# Altium project EL.T01.CVCM.PrjPcb (part 1 of 2)
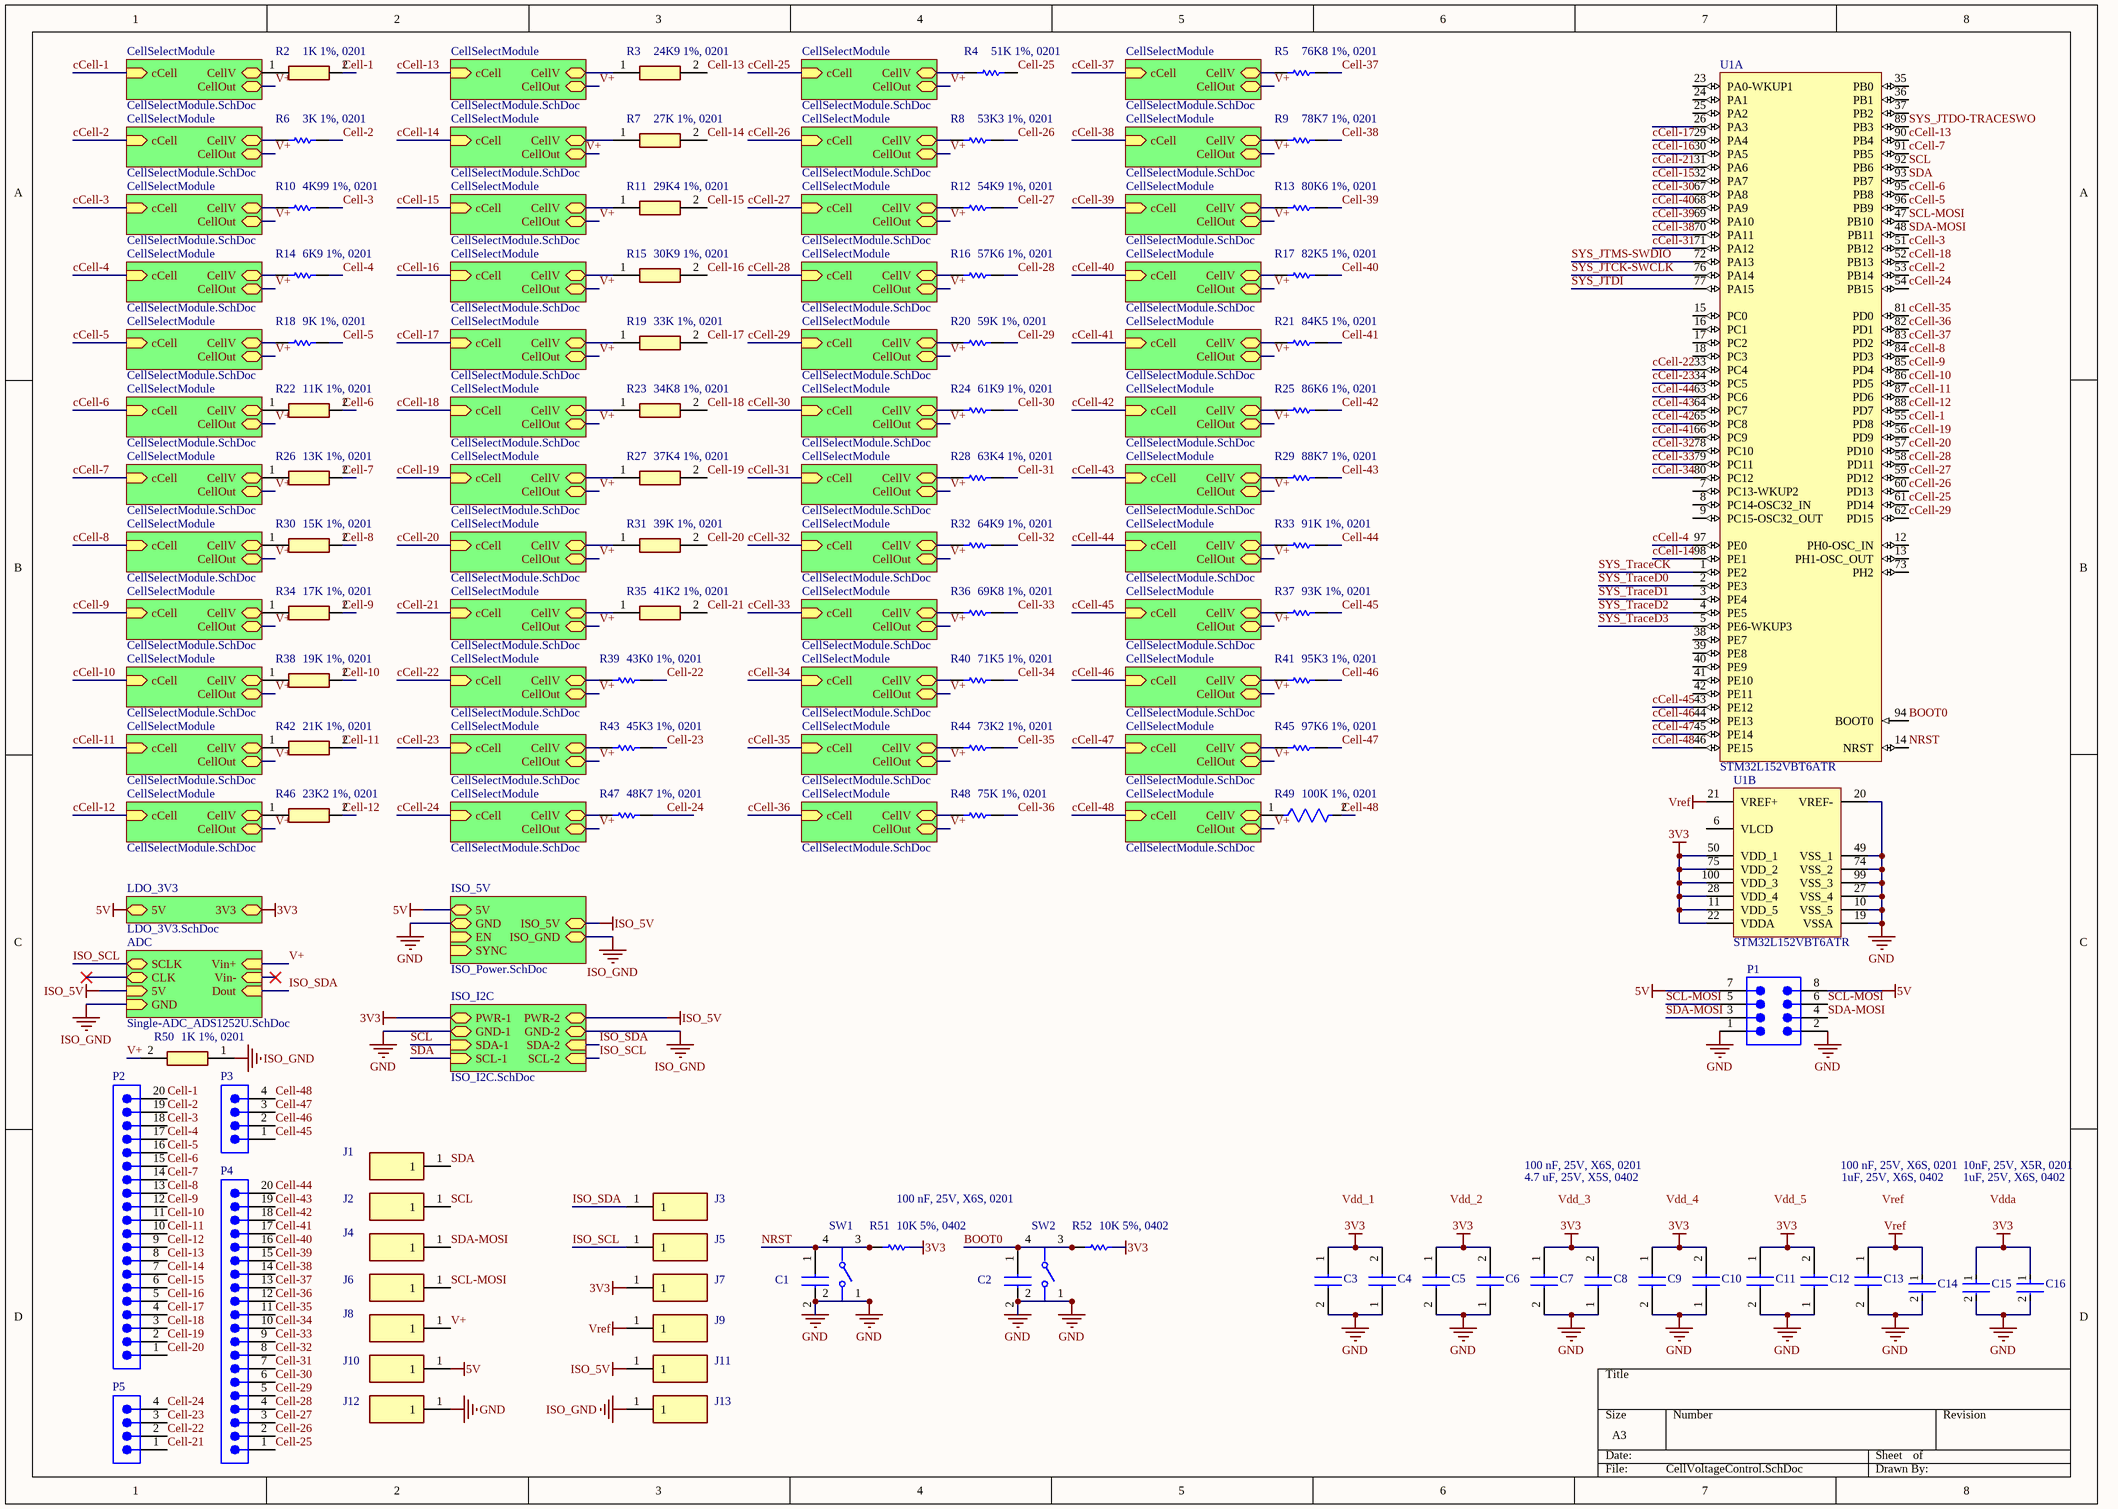
[diagram p0: CellVoltageControl.SchDoc]
7 sheets, 216 parts. Net scope: hierarchical (ports join the sheet entries above them; power ports are global).
Board file: CellVoltageControl.PcbDoc
Sheets:
  CellVoltageControl.SchDoc
    CellSelectModule = CellSelectModule.SchDoc
    CellSelectModule = CellSelectModule.SchDoc
    CellSelectModule = CellSelectModule.SchDoc
    CellSelectModule = CellSelectModule.SchDoc
    CellSelectModule = CellSelectModule.SchDoc
    CellSelectModule = CellSelectModule.SchDoc
    CellSelectModule = CellSelectModule.SchDoc
    CellSelectModule = CellSelectModule.SchDoc
    CellSelectModule = CellSelectModule.SchDoc
    CellSelectModule = CellSelectModule.SchDoc
    CellSelectModule = CellSelectModule.SchDoc
    CellSelectModule = CellSelectModule.SchDoc
    CellSelectModule = CellSelectModule.SchDoc
    CellSelectModule = CellSelectModule.SchDoc
    CellSelectModule = CellSelectModule.SchDoc
    CellSelectModule = CellSelectModule.SchDoc
    CellSelectModule = CellSelectModule.SchDoc
    CellSelectModule = CellSelectModule.SchDoc
    CellSelectModule = CellSelectModule.SchDoc
    CellSelectModule = CellSelectModule.SchDoc
    CellSelectModule = CellSelectModule.SchDoc
    CellSelectModule = CellSelectModule.SchDoc
    CellSelectModule = CellSelectModule.SchDoc
    CellSelectModule = CellSelectModule.SchDoc
    CellSelectModule = CellSelectModule.SchDoc
    CellSelectModule = CellSelectModule.SchDoc
    CellSelectModule = CellSelectModule.SchDoc
    CellSelectModule = CellSelectModule.SchDoc
    CellSelectModule = CellSelectModule.SchDoc
    CellSelectModule = CellSelectModule.SchDoc
    CellSelectModule = CellSelectModule.SchDoc
    CellSelectModule = CellSelectModule.SchDoc
    CellSelectModule = CellSelectModule.SchDoc
    CellSelectModule = CellSelectModule.SchDoc
    CellSelectModule = CellSelectModule.SchDoc
    CellSelectModule = CellSelectModule.SchDoc
    CellSelectModule = CellSelectModule.SchDoc
    CellSelectModule = CellSelectModule.SchDoc
    CellSelectModule = CellSelectModule.SchDoc
    CellSelectModule = CellSelectModule.SchDoc
    CellSelectModule = CellSelectModule.SchDoc
    CellSelectModule = CellSelectModule.SchDoc
    CellSelectModule = CellSelectModule.SchDoc
    CellSelectModule = CellSelectModule.SchDoc
    CellSelectModule = CellSelectModule.SchDoc
    CellSelectModule = CellSelectModule.SchDoc
    CellSelectModule = CellSelectModule.SchDoc
    CellSelectModule = CellSelectModule.SchDoc
    LDO_3V3 = LDO_3V3.SchDoc
    ISO_5V = ISO_Power.SchDoc
    ISO_I2C = ISO_I2C.SchDoc
    ADC = Single-ADC_ADS1252U.SchDoc
      Vref-2v5 = Reference_2V5.SchDoc

## Sheet CellVoltageControl.SchDoc
size A3; SheetNumber: 1; SheetTotal: 7

### Parts
C1  100 nF, 25V, X6S, 0201  [CAPC0603X33N]  (value not drawn)
C2  100 nF, 25V, X6S, 0201  [CAPC0603X33N]  (value not drawn)
C3  100 nF, 25V, X6S, 0201  [CAPC0603X33N]  (value not drawn)
C4  4.7 uF, 25V, X5S, 0402  [GRM15x]  (value not drawn)
C5  100 nF, 25V, X6S, 0201  [CAPC0603X33N]  (value not drawn)
C6  4.7 uF, 25V, X5S, 0402  [GRM15x]  (value not drawn)
C7  100 nF, 25V, X6S, 0201  [CAPC0603X33N]  (value not drawn)
C8  4.7 uF, 25V, X5S, 0402  [GRM15x]  (value not drawn)
C9  100 nF, 25V, X6S, 0201  [CAPC0603X33N]  (value not drawn)
C10  4.7 uF, 25V, X5S, 0402  [GRM15x]  (value not drawn)
C11  100 nF, 25V, X6S, 0201  [CAPC0603X33N]  (value not drawn)
C12  4.7 uF, 25V, X5S, 0402  [GRM15x]  (value not drawn)
C13  100 nF, 25V, X6S, 0201  [CAPC0603X33N]  (value not drawn)
C14  1uF, 25V, X6S, 0402  [FP-GRT155-0_1-IPC_A]  (value not drawn)
C15  10nF, 25V, X5R, 0201  [FP-GRM033-0_03-IPC_C]  (value not drawn)
C16  1uF, 25V, X6S, 0402  [FP-GRT155-0_1-IPC_A]  (value not drawn)
J1  TestPad  [TestPad]  (value not drawn)  (no BOM)
J2  TestPad  [TestPad]  (value not drawn)  (no BOM)
J3  TestPad  [TestPad]  (value not drawn)  (no BOM)
J4  TestPad  [TestPad]  (value not drawn)  (no BOM)
J5  TestPad  [TestPad]  (value not drawn)  (no BOM)
J6  TestPad  [TestPad]  (value not drawn)  (no BOM)
J7  TestPad  [TestPad]  (value not drawn)  (no BOM)
J8  TestPad  [TestPad]  (value not drawn)  (no BOM)
J9  TestPad  [TestPad]  (value not drawn)  (no BOM)
J10  TestPad  [TestPad]  (value not drawn)  (no BOM)
J11  TestPad  [TestPad]  (value not drawn)  (no BOM)
J12  TestPad  [TestPad]  (value not drawn)  (no BOM)
J13  TestPad  [TestPad]  (value not drawn)  (no BOM)
P1  61200821621  [61200821621]  (value not drawn)
P2  61302011121  [61302011121]  (value not drawn)
P3  61300411121  [61300411121]  (value not drawn)
P4  61302011121  [61302011121]  (value not drawn)
P5  61300411121  [61300411121]  (value not drawn)
R2  1K 1%, 0201  [ERJ1GN_(0201)]
R3  24K9 1%, 0201  [ERJ1GN_(0201)]
R4  51K 1%, 0201  [RESC0603X26X15NL03T05]
R5  76K8 1%, 0201  [RESC0603X26X15LL03T05]
R6  3K 1%, 0201  [RESC0603X26X15ML03T05]
R7  27K 1%, 0201  [ERJ1GN_(0201)]
R8  53K3 1%, 0201  [RESC0201(0603)_M]
R9  78K7 1%, 0201  [RESC0603X26X15NL03T05]
R10  4K99 1%, 0201  [RESC0603X26X15LL03T05]
R11  29K4 1%, 0201  [ERJ1GN_(0201)]
R12  54K9 1%, 0201  [RESC0603X26X15NL03T05]
R13  80K6 1%, 0201  [RESC0201(0603)_L]
R14  6K9 1%, 0201  [RESC0603X26X15NL03T05]
R15  30K9 1%, 0201  [ERJ1GN_(0201)]
R16  57K6 1%, 0201  [RESC0603X26X15NL03T05]
R17  82K5 1%, 0201  [RESC0603X26X15NL03T05]
R18  9K 1%, 0201  [RESC0603X26X15NL03T05]
R19  33K 1%, 0201  [ERJ1GN_(0201)]
R20  59K 1%, 0201  [RESC0603X26X15NL03T05]
R21  84K5 1%, 0201  [RESC0603X26X15NL03T05]
R22  11K 1%, 0201  [ERJ1GN_(0201)]
R23  34K8 1%, 0201  [ERJ1GN_(0201)]
R24  61K9 1%, 0201  [RESC0603X26X15NL03T05]
R25  86K6 1%, 0201  [RESC0603X26X15LL03T05]
R26  13K 1%, 0201  [ERJ1GN_(0201)]
R27  37K4 1%, 0201  [ERJ1GN_(0201)]
R28  63K4 1%, 0201  [RESC0201(0603)_M]
R29  88K7 1%, 0201  [RESC0603X26X15LL03T05]
R30  15K 1%, 0201  [ERJ1GJJ2R4C]
R31  39K 1%, 0201  [ERJ1GN_(0201)]
R32  64K9 1%, 0201  [RESC0603X26X15LL03T05]
R33  91K 1%, 0201  [RESC0603X26X15NL03T05]
R34  17K 1%, 0201  [ERJ1GN_(0201)]
R35  41K2 1%, 0201  [ERJ1GN_(0201)]
R36  69K8 1%, 0201  [RESC0603X26X15LL03T05]
R37  93K 1%, 0201  [RESC0201(0603)_L]
R38  19K 1%, 0201  [ERJ1GN_(0201)]
R39  43K0 1%, 0201  [RESC0603X26X15LL03T05]
R40  71K5 1%, 0201  [RESC0603X26X15LL03T05]
R41  95K3 1%, 0201  [RESC0603X26X15ML03T05]
R42  21K 1%, 0201  [ERJ1GN_(0201)]
R43  45K3 1%, 0201  [RESC0201(0603)_N]
R44  73K2 1%, 0201  [RESC0603X26X15NL03T05]
R45  97K6 1%, 0201  [RESC0603X26X15ML03T05]
R46  23K2 1%, 0201  [ERJ1GN_(0201)]
R47  48K7 1%, 0201  [RESC0603X26X15LL03T05]
R48  75K 1%, 0201  [RESC0603X26X15ML03T05]
R49  100K 1%, 0201  [FP-ERJ1GN-IPC_A]
R50  1K 1%, 0201  [ERJ1GN_(0201)]
R51  10K 5%, 0402  [RESC1005X40X25ML05T05]
R52  10K 5%, 0402  [RESC1005X40X25ML05T05]
SW1  PTS810SJM250SMTRLFS  [FP-PTS810SJM250SMTRLFS-MFG]  (value not drawn)
SW2  PTS810SJM250SMTRLFS  [FP-PTS810SJM250SMTRLFS-MFG]  (value not drawn)
U1  STM32L152VBT6ATR  [STM-LQFP100_L]  (parts A,B of 2)

### Sub-sheets
ADC = Single-ADC_ADS1252U.SchDoc: Vin+ (in), SCLK (bidir), CLK (bidir), Vin- (in), 5V (in), GND (in), Dout (in)
CellSelectModule = CellSelectModule.SchDoc: cCell (in), CellV (bidir), CellOut (bidir)
CellSelectModule = CellSelectModule.SchDoc: cCell (in), CellV (bidir), CellOut (bidir)
CellSelectModule = CellSelectModule.SchDoc: cCell (in), CellV (bidir), CellOut (bidir)
CellSelectModule = CellSelectModule.SchDoc: cCell (in), CellV (bidir), CellOut (bidir)
CellSelectModule = CellSelectModule.SchDoc: cCell (in), CellV (bidir), CellOut (bidir)
CellSelectModule = CellSelectModule.SchDoc: cCell (in), CellV (bidir), CellOut (bidir)
CellSelectModule = CellSelectModule.SchDoc: cCell (in), CellV (bidir), CellOut (bidir)
CellSelectModule = CellSelectModule.SchDoc: cCell (in), CellV (bidir), CellOut (bidir)
CellSelectModule = CellSelectModule.SchDoc: cCell (in), CellV (bidir), CellOut (bidir)
CellSelectModule = CellSelectModule.SchDoc: cCell (in), CellV (bidir), CellOut (bidir)
CellSelectModule = CellSelectModule.SchDoc: cCell (in), CellV (bidir), CellOut (bidir)
CellSelectModule = CellSelectModule.SchDoc: cCell (in), CellV (bidir), CellOut (bidir)
CellSelectModule = CellSelectModule.SchDoc: cCell (in), CellV (bidir), CellOut (bidir)
CellSelectModule = CellSelectModule.SchDoc: cCell (in), CellV (bidir), CellOut (bidir)
CellSelectModule = CellSelectModule.SchDoc: cCell (in), CellV (bidir), CellOut (bidir)
CellSelectModule = CellSelectModule.SchDoc: cCell (in), CellV (bidir), CellOut (bidir)
CellSelectModule = CellSelectModule.SchDoc: cCell (in), CellV (bidir), CellOut (bidir)
CellSelectModule = CellSelectModule.SchDoc: cCell (in), CellV (bidir), CellOut (bidir)
CellSelectModule = CellSelectModule.SchDoc: cCell (in), CellV (bidir), CellOut (bidir)
CellSelectModule = CellSelectModule.SchDoc: cCell (in), CellV (bidir), CellOut (bidir)
CellSelectModule = CellSelectModule.SchDoc: cCell (in), CellV (bidir), CellOut (bidir)
CellSelectModule = CellSelectModule.SchDoc: cCell (in), CellV (bidir), CellOut (bidir)
CellSelectModule = CellSelectModule.SchDoc: cCell (in), CellV (bidir), CellOut (bidir)
CellSelectModule = CellSelectModule.SchDoc: cCell (in), CellV (bidir), CellOut (bidir)
CellSelectModule = CellSelectModule.SchDoc: cCell (in), CellV (bidir), CellOut (bidir)
CellSelectModule = CellSelectModule.SchDoc: cCell (in), CellV (bidir), CellOut (bidir)
CellSelectModule = CellSelectModule.SchDoc: cCell (in), CellV (bidir), CellOut (bidir)
CellSelectModule = CellSelectModule.SchDoc: cCell (in), CellV (bidir), CellOut (bidir)
CellSelectModule = CellSelectModule.SchDoc: cCell (in), CellV (bidir), CellOut (bidir)
CellSelectModule = CellSelectModule.SchDoc: cCell (in), CellV (bidir), CellOut (bidir)
CellSelectModule = CellSelectModule.SchDoc: cCell (in), CellV (bidir), CellOut (bidir)
CellSelectModule = CellSelectModule.SchDoc: cCell (in), CellV (bidir), CellOut (bidir)
CellSelectModule = CellSelectModule.SchDoc: cCell (in), CellV (bidir), CellOut (bidir)
CellSelectModule = CellSelectModule.SchDoc: cCell (in), CellV (bidir), CellOut (bidir)
CellSelectModule = CellSelectModule.SchDoc: cCell (in), CellV (bidir), CellOut (bidir)
CellSelectModule = CellSelectModule.SchDoc: cCell (in), CellV (bidir), CellOut (bidir)
CellSelectModule = CellSelectModule.SchDoc: cCell (in), CellV (bidir), CellOut (bidir)
CellSelectModule = CellSelectModule.SchDoc: cCell (in), CellV (bidir), CellOut (bidir)
CellSelectModule = CellSelectModule.SchDoc: cCell (in), CellV (bidir), CellOut (bidir)
CellSelectModule = CellSelectModule.SchDoc: cCell (in), CellV (bidir), CellOut (bidir)
CellSelectModule = CellSelectModule.SchDoc: cCell (in), CellV (bidir), CellOut (bidir)
CellSelectModule = CellSelectModule.SchDoc: cCell (in), CellV (bidir), CellOut (bidir)
CellSelectModule = CellSelectModule.SchDoc: cCell (in), CellV (bidir), CellOut (bidir)
CellSelectModule = CellSelectModule.SchDoc: cCell (in), CellV (bidir), CellOut (bidir)
CellSelectModule = CellSelectModule.SchDoc: cCell (in), CellV (bidir), CellOut (bidir)
CellSelectModule = CellSelectModule.SchDoc: cCell (in), CellV (bidir), CellOut (bidir)
CellSelectModule = CellSelectModule.SchDoc: cCell (in), CellV (bidir), CellOut (bidir)
CellSelectModule = CellSelectModule.SchDoc: cCell (in), CellV (bidir), CellOut (bidir)
ISO_5V = ISO_Power.SchDoc: ISO_5V (bidir), 5V (bidir), GND (bidir), ISO_GND (bidir), EN (in), SYNC (in)
ISO_I2C = ISO_I2C.SchDoc: PWR-2 (bidir), PWR-1 (bidir), GND-1 (bidir), GND-2 (bidir), SDA-1 (in), SCL-1 (in), SDA-2 (in), SCL-2 (in)
LDO_3V3 = LDO_3V3.SchDoc: 3V3 (bidir), 5V (bidir)

### Nets
3V3: C3.1 C4.2 C5.1 C6.2 C7.1 C8.2 C9.1 C10.2 C11.1 C12.2 C15.1 C16.1 J7.1 R51.1 R52.1 U1.11(VDD_5) U1.22(VDDA) U1.28(VDD_4) U1.50(VDD_1) U1.75(VDD_2) U1.100(VDD_3) ; sheet LDO_3V3/3V3, sheet ISO_I2C/PWR-1
5V: J10.1 P1.7 P1.8 ; sheet LDO_3V3/5V, sheet ISO_5V/5V
GND: C1.2 C2.2 C3.2 C4.1 C5.2 C6.1 C7.2 C8.1 C9.2 C10.1 C11.2 C12.1 C13.2 C14.2 C15.2 C16.2 J12.1 P1.1 P1.2 SW1.1 SW1.2 SW2.1 SW2.2 U1.10(VSS_5) U1.19(VSSA) U1.20(VREF-) U1.27(VSS_4) U1.49(VSS_1) U1.74(VSS_2) U1.99(VSS_3) ; sheet ISO_5V/GND, sheet ISO_I2C/GND-1
ISO_5V: J11.1 ; sheet ISO_5V/ISO_5V, sheet ISO_I2C/PWR-2, sheet ADC/5V
ISO_GND: J13.1 R50.1 ; sheet ISO_5V/ISO_GND, sheet ISO_I2C/GND-2, sheet ADC/GND
Vref: C13.1 C14.1 J9.1 U1.21(VREF+)
BOOT0: C2.1 R52.2 SW2.3 SW2.4 U1.94(BOOT0)
cCell-1: U1.55(PD8) ; sheet CellSelectModule/cCell
cCell-2: U1.53(PB14) ; sheet CellSelectModule/cCell
cCell-3: U1.51(PB12) ; sheet CellSelectModule/cCell
cCell-4: U1.97(PE0) ; sheet CellSelectModule/cCell
cCell-5: U1.96(PB9) ; sheet CellSelectModule/cCell
cCell-6: U1.95(PB8) ; sheet CellSelectModule/cCell
cCell-7: U1.91(PB5) ; sheet CellSelectModule/cCell
cCell-8: U1.84(PD3) ; sheet CellSelectModule/cCell
cCell-9: U1.85(PD4) ; sheet CellSelectModule/cCell
cCell-10: U1.86(PD5) ; sheet CellSelectModule/cCell
cCell-11: U1.87(PD6) ; sheet CellSelectModule/cCell
cCell-12: U1.88(PD7) ; sheet CellSelectModule/cCell
cCell-13: U1.90(PB4) ; sheet CellSelectModule/cCell
cCell-14: U1.98(PE1) ; sheet CellSelectModule/cCell
cCell-15: U1.32(PA7) ; sheet CellSelectModule/cCell
cCell-16: U1.30(PA5) ; sheet CellSelectModule/cCell
cCell-17: U1.29(PA4) ; sheet CellSelectModule/cCell
cCell-18: U1.52(PB13) ; sheet CellSelectModule/cCell
cCell-19: U1.56(PD9) ; sheet CellSelectModule/cCell
cCell-20: U1.57(PD10) ; sheet CellSelectModule/cCell
cCell-21: U1.31(PA6) ; sheet CellSelectModule/cCell
cCell-22: U1.33(PC4) ; sheet CellSelectModule/cCell
cCell-23: U1.34(PC5) ; sheet CellSelectModule/cCell
cCell-24: U1.54(PB15) ; sheet CellSelectModule/cCell
cCell-25: U1.61(PD14) ; sheet CellSelectModule/cCell
cCell-26: U1.60(PD13) ; sheet CellSelectModule/cCell
cCell-27: U1.59(PD12) ; sheet CellSelectModule/cCell
cCell-28: U1.58(PD11) ; sheet CellSelectModule/cCell
cCell-29: U1.62(PD15) ; sheet CellSelectModule/cCell
cCell-30: U1.67(PA8) ; sheet CellSelectModule/cCell
cCell-31: U1.71(PA12) ; sheet CellSelectModule/cCell
cCell-32: U1.78(PC10) ; sheet CellSelectModule/cCell
cCell-33: U1.79(PC11) ; sheet CellSelectModule/cCell
cCell-34: U1.80(PC12) ; sheet CellSelectModule/cCell
cCell-35: U1.81(PD0) ; sheet CellSelectModule/cCell
cCell-36: U1.82(PD1) ; sheet CellSelectModule/cCell
cCell-37: U1.83(PD2) ; sheet CellSelectModule/cCell
cCell-38: U1.70(PA11) ; sheet CellSelectModule/cCell
cCell-39: U1.69(PA10) ; sheet CellSelectModule/cCell
cCell-40: U1.68(PA9) ; sheet CellSelectModule/cCell
cCell-41: U1.66(PC9) ; sheet CellSelectModule/cCell
cCell-42: U1.65(PC8) ; sheet CellSelectModule/cCell
cCell-43: U1.64(PC7) ; sheet CellSelectModule/cCell
cCell-44: U1.63(PC6) ; sheet CellSelectModule/cCell
cCell-45: U1.43(PE12) ; sheet CellSelectModule/cCell
cCell-46: U1.44(PE13) ; sheet CellSelectModule/cCell
cCell-47: U1.45(PE14) ; sheet CellSelectModule/cCell
cCell-48: U1.46(PE15) ; sheet CellSelectModule/cCell
Cell-1: P2.20 R2.2
Cell-2: P2.19 R6.2
Cell-3: P2.18 R10.2
Cell-4: P2.17 R14.2
Cell-5: P2.16 R18.2
Cell-6: P2.15 R22.2
Cell-7: P2.14 R26.2
Cell-8: P2.13 R30.2
Cell-9: P2.12 R34.2
Cell-10: P2.11 R38.2
Cell-11: P2.10 R42.2
Cell-12: P2.9 R46.2
Cell-13: P2.8 R3.2
Cell-14: P2.7 R7.2
Cell-15: P2.6 R11.2
Cell-16: P2.5 R15.2
Cell-17: P2.4 R19.2
Cell-18: P2.3 R23.2
Cell-19: P2.2 R27.2
Cell-20: P2.1 R31.2
Cell-21: P5.1 R35.2
Cell-22: P5.2 R39.2
Cell-23: P5.3 R43.2
Cell-24: P5.4 R47.2
Cell-25: P4.1 R4.2
Cell-26: P4.2 R8.2
Cell-27: P4.3 R12.2
Cell-28: P4.4 R16.2
Cell-29: P4.5 R20.2
Cell-30: P4.6 R24.2
Cell-31: P4.7 R28.2
Cell-32: P4.8 R32.2
Cell-33: P4.9 R36.2
Cell-34: P4.10 R40.2
Cell-35: P4.11 R44.2
Cell-36: P4.12 R48.2
Cell-37: P4.13 R5.2
Cell-38: P4.14 R9.2
Cell-39: P4.15 R13.2
Cell-40: P4.16 R17.2
Cell-41: P4.17 R21.2
Cell-42: P4.18 R25.2
Cell-43: P4.19 R29.2
Cell-44: P4.20 R33.2
Cell-45: P3.1 R37.2
Cell-46: P3.2 R41.2
Cell-47: P3.3 R45.2
Cell-48: P3.4 R49.2
ISO_SCL: J5.1 ; sheet ISO_I2C/SCL-2, sheet ADC/SCLK
ISO_SDA: J3.1 ; sheet ISO_I2C/SDA-2, sheet ADC/Dout
NRST: C1.1 R51.2 SW1.3 SW1.4 U1.14(NRST)
SCL: J2.1 U1.92(PB6) ; sheet ISO_I2C/SDA-1
SCL-MOSI: J6.1 P1.5 P1.6 U1.47(PB10)
SDA: J1.1 U1.93(PB7) ; sheet ISO_I2C/SCL-1
SDA-MOSI: J4.1 P1.3 P1.4 U1.48(PB11)
SYS_JTCK-SWCLK: U1.76(PA14)
SYS_JTDI: U1.77(PA15)
SYS_JTDO-TRACESWO: U1.89(PB3)
SYS_JTMS-SWDIO: U1.72(PA13)
SYS_TraceCK: U1.1(PE2)
SYS_TraceD0: U1.2(PE3)
SYS_TraceD1: U1.3(PE4)
SYS_TraceD2: U1.4(PE5)
SYS_TraceD3: U1.5(PE6-WKUP3)
V+: J8.1 R50.2 ; sheet CellSelectModule/CellOut, sheet CellSelectModule/CellOut, sheet CellSelectModule/CellOut, sheet CellSelectModule/CellOut, sheet CellSelectModule/CellOut, sheet CellSelectModule/CellOut, sheet CellSelectModule/CellOut, sheet CellSelectModule/CellOut, sheet CellSelectModule/CellOut, sheet CellSelectModule/CellOut, sheet CellSelectModule/CellOut, sheet CellSelectModule/CellOut, sheet CellSelectModule/CellOut, sheet CellSelectModule/CellOut, sheet CellSelectModule/CellOut, sheet CellSelectModule/CellOut, sheet CellSelectModule/CellOut, sheet CellSelectModule/CellOut, sheet CellSelectModule/CellOut, sheet CellSelectModule/CellOut, sheet CellSelectModule/CellOut, sheet CellSelectModule/CellOut, sheet CellSelectModule/CellOut, sheet CellSelectModule/CellOut, sheet CellSelectModule/CellOut, sheet CellSelectModule/CellOut, sheet CellSelectModule/CellOut, sheet CellSelectModule/CellOut, sheet CellSelectModule/CellOut, sheet CellSelectModule/CellOut, sheet CellSelectModule/CellOut, sheet CellSelectModule/CellOut, sheet CellSelectModule/CellOut, sheet CellSelectModule/CellOut, sheet CellSelectModule/CellOut, sheet CellSelectModule/CellOut, sheet CellSelectModule/CellOut, sheet CellSelectModule/CellOut, sheet CellSelectModule/CellOut, sheet CellSelectModule/CellOut, sheet CellSelectModule/CellOut, sheet CellSelectModule/CellOut, sheet CellSelectModule/CellOut, sheet CellSelectModule/CellOut, sheet CellSelectModule/CellOut, sheet CellSelectModule/CellOut, sheet CellSelectModule/CellOut, sheet CellSelectModule/CellOut, sheet ADC/Vin+
NetK1_CellSelectModule#1_4: R2.1 ; sheet CellSelectModule/CellV
NetK1_CellSelectModule#2_4: R9.1 ; sheet CellSelectModule/CellV
NetK1_CellSelectModule#3_4: R13.1 ; sheet CellSelectModule/CellV
NetK1_CellSelectModule#4_4: R17.1 ; sheet CellSelectModule/CellV
NetK1_CellSelectModule#5_4: R21.1 ; sheet CellSelectModule/CellV
NetK1_CellSelectModule#6_4: R25.1 ; sheet CellSelectModule/CellV
NetK1_CellSelectModule#7_4: R29.1 ; sheet CellSelectModule/CellV
NetK1_CellSelectModule#8_4: R33.1 ; sheet CellSelectModule/CellV
NetK1_CellSelectModule#9_4: R37.1 ; sheet CellSelectModule/CellV
NetK1_CellSelectModule#10_4: R41.1 ; sheet CellSelectModule/CellV
NetK1_CellSelectModule#11_4: R45.1 ; sheet CellSelectModule/CellV
NetK1_CellSelectModule#12_4: R49.1 ; sheet CellSelectModule/CellV
NetK1_CellSelectModule#13_4: R8.1 ; sheet CellSelectModule/CellV
NetK1_CellSelectModule#14_4: R12.1 ; sheet CellSelectModule/CellV
NetK1_CellSelectModule#15_4: R16.1 ; sheet CellSelectModule/CellV
NetK1_CellSelectModule#16_4: R20.1 ; sheet CellSelectModule/CellV
NetK1_CellSelectModule#17_4: R24.1 ; sheet CellSelectModule/CellV
NetK1_CellSelectModule#18_4: R28.1 ; sheet CellSelectModule/CellV
NetK1_CellSelectModule#19_4: R32.1 ; sheet CellSelectModule/CellV
NetK1_CellSelectModule#20_4: R36.1 ; sheet CellSelectModule/CellV
NetK1_CellSelectModule#21_4: R40.1 ; sheet CellSelectModule/CellV
NetK1_CellSelectModule#22_4: R44.1 ; sheet CellSelectModule/CellV
NetK1_CellSelectModule#23_4: R48.1 ; sheet CellSelectModule/CellV
NetK1_CellSelectModule#24_4: R5.1 ; sheet CellSelectModule/CellV
NetK1_CellSelectModule#25_4: R7.1 ; sheet CellSelectModule/CellV
NetK1_CellSelectModule#26_4: R11.1 ; sheet CellSelectModule/CellV
NetK1_CellSelectModule#27_4: R15.1 ; sheet CellSelectModule/CellV
NetK1_CellSelectModule#28_4: R19.1 ; sheet CellSelectModule/CellV
NetK1_CellSelectModule#29_4: R23.1 ; sheet CellSelectModule/CellV
NetK1_CellSelectModule#30_4: R27.1 ; sheet CellSelectModule/CellV
NetK1_CellSelectModule#31_4: R31.1 ; sheet CellSelectModule/CellV
NetK1_CellSelectModule#32_4: R35.1 ; sheet CellSelectModule/CellV
NetK1_CellSelectModule#33_4: R39.1 ; sheet CellSelectModule/CellV
NetK1_CellSelectModule#34_4: R43.1 ; sheet CellSelectModule/CellV
NetK1_CellSelectModule#35_4: R47.1 ; sheet CellSelectModule/CellV
NetK1_CellSelectModule#36_4: R4.1 ; sheet CellSelectModule/CellV
NetK1_CellSelectModule#37_4: R6.1 ; sheet CellSelectModule/CellV
NetK1_CellSelectModule#38_4: R10.1 ; sheet CellSelectModule/CellV
NetK1_CellSelectModule#39_4: R14.1 ; sheet CellSelectModule/CellV
NetK1_CellSelectModule#40_4: R18.1 ; sheet CellSelectModule/CellV
NetK1_CellSelectModule#41_4: R22.1 ; sheet CellSelectModule/CellV
NetK1_CellSelectModule#42_4: R26.1 ; sheet CellSelectModule/CellV
NetK1_CellSelectModule#43_4: R30.1 ; sheet CellSelectModule/CellV
NetK1_CellSelectModule#44_4: R34.1 ; sheet CellSelectModule/CellV
NetK1_CellSelectModule#45_4: R38.1 ; sheet CellSelectModule/CellV
NetK1_CellSelectModule#46_4: R42.1 ; sheet CellSelectModule/CellV
NetK1_CellSelectModule#47_4: R46.1 ; sheet CellSelectModule/CellV
NetK1_CellSelectModule#48_4: R3.1 ; sheet CellSelectModule/CellV

Not connected (* = marked no-connect by the designer): U1 6(VLCD) 7(PC13-WKUP2) 8(PC14-OSC32_IN) 9(PC15-OSC32_OUT) 12(PH0-OSC_IN) 13(PH1-OSC_OUT) 15(PC0) 16(PC1) 17(PC2) 18(PC3) 23(PA0-WKUP1) 24(PA1) 25(PA2) 26(PA3) 35(PB0) 36(PB1) 37(PB2) 38(PE7) 39(PE8) 40(PE9) 41(PE10) 42(PE11) 73(PH2)

### Notes on the sheet
- 4.7 uF, 25V, X5S, 0402
- 100 nF, 25V, X6S, 0201
- 1uF, 25V, X6S, 0402
- 10nF, 25V, X5R, 0201
- Vdd_1
- Vdd_2
- Vdd_3
- Vdd_4
- Vdd_5
- Vref
- Vdda

### Library data of the parts
C1-C3 C5 C7 C9 C11 C13 = GRM033C81E104KE14D: Capacitor; Manufacturer_Name: Murata Electronics; Datasheet Link: https://search.murata.co.jp/Ceramy/image/img/A01X/G101/ENG/GRM033C81E104KE14-01A.pdf; Height: 0.33mm; Manufacturer_Part_Number: GRM033C81E104KE14D; Mouser Part Number: 81-GRM33C81E104KE14D; Mouser Price/Stock: https://www.mouser.co.uk/ProductDetail/Murata-Electronics/GRM033C81E104KE14D?qs=P%2FC4Eoq9CDwxe7d5nXqGrA%3D%3D; Arrow Part Number: GRM033C81E104KE14D; Arrow Price/Stock: https://www.arrow.com/en/products/grm033c81e104ke14d/murata-manufacturing
C4 C6 C8 C10 C12 = GRM155C61E475ME15J: Capacitor; Manufacturer_Name: Murata Electronics; Datasheet Link: https://search.murata.co.jp/Ceramy/image/img/A01X/G101/ENG/GRM155C61E475ME15-01A.pdf; Height: 0.33mm; Manufacturer_Part_Number: GRM155C61E475ME15J; Mouser Part Number: 81-GRM15C61E475ME15J; Mouser Price/Stock: https://www.mouser.co.uk/ProductDetail/Murata-Electronics/GRM155C61E475ME15J?qs=By6Nw2ByBD02p8xq06vhEQ%3D%3D; Arrow Part Number: GRM155C61E475ME15J; Arrow Price/Stock: https://www.arrow.com/en/products/grm155c61e475me15j/murata-manufacturing?region=nac
C14 C16 = CMP-06035-047663-1: Multi-Layer Ceramic Capacitor 1uF 25V X6S ±10% 0402 Paper T/R
C15 = CMP-2010-01269-2: Chip Multilayer Ceramic Capacitors for General Purpose, 0201, 10000pF, X5R, 15%, 10%, 25V; Capacitance: 10nF; Weight: 1.2E-05oz; Tolerance: 10%; Length: 0.6mm; Case Code (Metric): 0603; Min Operating Temperature: -55°C; Lead Free: Lead Free; Mount: Surface Mount; Voltage: 25V; REACH SVHC: No SVHC; Dielectric: X5R; Case Code (Imperial): 0201; Depth: 0.3mm; Packaging: Tape and Reel; Package Quantity: 15000; Case/Package: 0201; Voltage Rating (DC): 25V; Height: 0.3mm; Max Operating Temperature: 85°C; Termination: SMD/SMT; Voltage Rating: 25V; Width: 0.3mm; Thickness: 0.013inch
J1-J13 = 61300111121: Connector; Manufacturer_Name: Wurth Elektronik; Datasheet Link: https://katalog.we-online.de/em/datasheet/6130xx11121.pdf; Height: 8.89mm; Manufacturer_Part_Number: 61300111121; Mouser Part Number: 710-61300111121; Mouser Price/Stock: https://www.mouser.co.uk/ProductDetail/Wurth-Elektronik/61300111121?qs=PhR8RmCirEaRH5Ck%252B2lRLQ%3D%3D
P1 = CMP-1502-00006-2: NexarPartId: 32855460; Gender: Male; Row Spacing: 2.54mm; Connector Type: Male Pin; Insulation Resistance: 1GΩ; Contact Resistance: 20mΩ; Number of Positions: 8; Current Rating: 3A; Operating Supply Voltage: 250V; Orientation: Vertical; Lead Pitch: 2.54mm; Length: 17.82mm; Max Operating Temperature: 105°C; Mount: Through Hole; Color: Black; Insulation Material: PBT; RoHS: Compliant; Contact Material: Copper; Number of Contacts: 8; Pitch: 2.54mm; Contact Plating: Gold; Min Operating Temperature: -40°C; Number of Pins: 8; Termination: Solder; REACH SVHC: Unknown; Number of Rows: 2
P2 P4 = CMP-1502-01102-3: NexarPartId: 32855554; Operating Supply Voltage: 250V; Gender: Male; Current Rating: 3A; Contact Resistance: 20mΩ; Number of Contacts: 20; Pitch: 2.54mm; Connector Type: Male Pin; RoHS: Compliant; Contact Plating: Gold; REACH SVHC: Unknown; Packaging: Bulk; Lead Pitch: 2.54mm; Mount: Through Hole; Termination: Solder; Number of Pins: 20; Contact Mating Length: 5.9944mm; Number of Rows: 1; Color: Black; Contact Material: Copper; Orientation: Vertical; Number of Positions: 20
P3 P5 = CMP-1502-01064-3: NexarPartId: 32855522; Operating Supply Voltage: 250V; Pitch: 2.54mm; Contact Resistance: 20mΩ; Number of Positions: 4; Current Rating: 3A; Connector Type: Male Pin; Gender: Male; Contact Plating: Gold; Height: 8.89mm; Lead Pitch: 2.54mm; Lead Free: Lead Free; Contact Mating Length: 5.9944mm; Number of Rows: 1; Termination: Solder; Packaging: Bulk; REACH SVHC: Unknown; Min Operating Temperature: -40°C; RoHS: Compliant; Number of Contacts: 4; Voltage Rating: 250V; Color: Black; Max Operating Temperature: 105°C; Contact Material: Copper; Mount: Through Hole; Orientation: Vertical; Number of Pins: 4
R2 R50 = ERJ-1GNF1001C: Resistor; Manufacturer_Name: Panasonic; Datasheet Link: https://industrial.panasonic.com/cdbs/www-data/pdf/RDA0000/AOA0000C301.pdf; Height: 0.26mm; Manufacturer_Part_Number: ERJ-1GNF1001C; Mouser Part Number: 667-ERJ-1GNF1001C; Mouser Price/Stock: https://www.mouser.co.uk/ProductDetail/Panasonic/ERJ-1GNF1001C?qs=nuXzIS8loXFEaL2ux1uJzQ%3D%3D; Arrow Part Number: ERJ-1GNF1001C; Arrow Price/Stock: https://www.arrow.com/en/products/erj-1gnf1001c/panasonic?utm_currency=USD&region=nac
R3 = ERJ-1GNF2492C: Resistor; Manufacturer_Name: Panasonic; Datasheet Link: https://industrial.panasonic.com/cdbs/www-data/pdf/RDA0000/AOA0000C301.pdf; Height: 0.26mm; Manufacturer_Part_Number: ERJ-1GNF2492C; Mouser Part Number: 667-ERJ-1GNF2492C; Mouser Price/Stock: https://www.mouser.com/Search/Refine.aspx?Keyword=667-ERJ-1GNF2492C
R4 = CMP-1010-00609-2: Part Number: ERJ1GNF5102C; Manufacturer: Panasonic
R5 = CMP-1010-00629-2: Manufacturer: Panasonic; Part Number: ERJ-1GNF7682C
R6 = CMP-2004-03538-1: Manufacturer: Panasonic; Part Number: ERJ1GNF3001C
R7 = ERJ-1GNF2702C: Resistor; Manufacturer_Name: Panasonic; Datasheet Link: https://industrial.panasonic.com/cdbs/www-data/pdf/RDA0000/AOA0000C301.pdf; Height: 0.26mm; Manufacturer_Part_Number: ERJ-1GNF2702C; Mouser Part Number: 667-ERJ-1GNF2702C; Mouser Price/Stock: https://www.mouser.com/Search/Refine.aspx?Keyword=667-ERJ-1GNF2702C
R8 = CMP-1010-00612-1: 53K6 0.05W 1% 0201 (0603 Metric)  SMD; Value: 53600.00 Ohm; Case-Metric: 0603; Case-EIA: 0201; Power: 0.05 W; Technology: SMT; Tolerance: 1 %
R9 = CMP-2004-03417-1: Part Number: ERJ-1GNF7872C; Manufacturer: Panasonic
R10 = CMP-2004-03370-1: Part Number: ERJ-1GNF4991C; Manufacturer: Panasonic
R11 = ERJ-1GNF2942C: Resistor; Manufacturer_Name: Panasonic; Datasheet Link: https://industrial.panasonic.com/cdbs/www-data/pdf/RDA0000/AOA0000C301.pdf; Height: 0.26mm; Manufacturer_Part_Number: ERJ-1GNF2942C; Mouser Part Number: 667-ERJ-1GNF2942C; Mouser Price/Stock: https://www.mouser.co.uk/ProductDetail/Panasonic/ERJ-1GNF2942C?qs=nuXzIS8loXGe%252BX5VKurVfQ%3D%3D; Arrow Part Number: ERJ-1GNF2942C; Arrow Price/Stock: https://www.arrow.com/en/products/erj-1gnf2942c/panasonic
R12 = CMP-1010-00613-2: Manufacturer: Panasonic; Part Number: ERJ-1GNF5492C
R13 = CMP-1010-00631-1: 80K6 0.05W 1% 0201 (0603 Metric)  SMD; Case-EIA: 0201; Value: 80600.00 Ohm; Case-Metric: 0603; Power: 0.05 W; Tolerance: 1 %; Technology: SMT
R14 = CMP-2004-03407-1: Manufacturer: Panasonic; Part Number: ERJ-1GNF6981C
R15 = ERJ-1GNF3092C: Resistor; Manufacturer_Name: Panasonic; Datasheet Link: https://industrial.panasonic.com/cdbs/www-data/pdf/RDA0000/AOA0000C301.pdf; Height: 0.26mm; Manufacturer_Part_Number: ERJ-1GNF3092C; Mouser Part Number: 667-ERJ-1GNF3092C; Mouser Price/Stock: https://www.mouser.com/Search/Refine.aspx?Keyword=667-ERJ-1GNF3092C
R16 = CMP-2004-03020-1: Part Number: ERJ-1GEF5762C; Manufacturer: Panasonic
R17 = CMP-1010-00633-2: Part Number: ERJ-1GNF8252C; Manufacturer: Panasonic
R18 = CMP-2004-03433-1: Part Number: ERJ-1GNF9091C; Manufacturer: Panasonic
R19 = ERJ-1GNF3302C: Resistor; Manufacturer_Name: Panasonic; Datasheet Link: https://industrial.panasonic.com/cdbs/www-data/pdf/RDA0000/AOA0000C301.pdf; Height: 0.26mm; Manufacturer_Part_Number: ERJ-1GNF3302C; Mouser Part Number: 667-ERJ-1GNF3302C; Mouser Price/Stock: https://www.mouser.co.uk/ProductDetail/Panasonic/ERJ-1GNF3302C?qs=nuXzIS8loXGkny9nADUO%252BQ%3D%3D
R20 = CMP-2004-03025-1: Manufacturer: Panasonic; Part Number: ERJ-1GEF5902C
R21 = CMP-2004-03424-1: Manufacturer: Panasonic; Part Number: ERJ-1GNF8452C
R22 = ERJ-1GNF1102C: Resistor; Manufacturer_Name: Panasonic; Datasheet Link: https://industrial.panasonic.com/cdbs/www-data/pdf/RDA0000/AOA0000C301.pdf; Height: 0.26mm; Manufacturer_Part_Number: ERJ-1GNF1102C
R23 = ERJ-1GNF3482C: Resistor; Manufacturer_Name: Panasonic; Datasheet Link: https://industrial.panasonic.com/cdbs/www-data/pdf/RDA0000/AOA0000C301.pdf; Height: 0.26mm; Manufacturer_Part_Number: ERJ-1GNF3482C; Mouser Part Number: 667-ERJ-1GNF3482C; Mouser Price/Stock: https://www.mouser.com/Search/Refine.aspx?Keyword=667-ERJ-1GNF3482C
R24 = CMP-2004-03397-1: Part Number: ERJ-1GNF6192C; Manufacturer: Panasonic
R25 = CMP-1010-00635-2: Manufacturer: Panasonic; Part Number: ERJ-1GNF8662C
R26 = ERJ-1GNF1302C: Resistor; Manufacturer_Name: Panasonic; Datasheet Link: https://industrial.panasonic.com/cdbs/www-data/pdf/RDA0000/AOA0000C301.pdf; Height: 0.26mm; Manufacturer_Part_Number: ERJ-1GNF1302C; Arrow Part Number: ERJ-1GNF1302C; Arrow Price/Stock: https://www.arrow.com/en/products/erj-1gnf1302c/panasonic
R27 = ERJ-1GNF3742C: Resistor; Manufacturer_Name: Panasonic; Datasheet Link: https://industrial.panasonic.com/cdbs/www-data/pdf/RDA0000/AOA0000C301.pdf; Height: 0.26mm; Manufacturer_Part_Number: ERJ-1GNF3742C; Mouser Part Number: 667-ERJ-1GNF3742C; Mouser Price/Stock: https://www.mouser.co.uk/ProductDetail/Panasonic/ERJ-1GNF3742C?qs=nuXzIS8loXEad9H565qrAg%3D%3D; Arrow Part Number: ERJ-1GNF3742C; Arrow Price/Stock: https://www.arrow.com/en/products/erj-1gnf3742c/panasonic?utm_currency=USD&region=nac
R28 = CMP-1010-00620-1: 63K4 0.05W 1% 0201 (0603 Metric)  SMD; Value: 63400.00 Ohm; Case-EIA: 0201; Case-Metric: 0603; Technology: SMT; Tolerance: 1 %; Power: 0.05 W
R29 = CMP-2004-03430-1: Manufacturer: Panasonic; Part Number: ERJ-1GNF8872C
R30 = ERJ-1GJF1502C: Resistor; Manufacturer_Name: Panasonic; Datasheet Link: https://industrial.panasonic.com/cdbs/www-data/pdf/RDA0000/AOA0000C304.pdf; Height: 0.26mm; Manufacturer_Part_Number: ERJ-1GJF1502C; Mouser Part Number: 667-ERJ-1GJF1502C; Mouser Price/Stock: https://www.mouser.co.uk/ProductDetail/Panasonic/ERJ-1GJF1502C?qs=OcgtsXO%252B3gsxVA8R4OwezA%3D%3D; Arrow Part Number: ERJ-1GJF1502C; Arrow Price/Stock: https://www.arrow.com/en/products/erj-1gjf1502c/panasonic?utm_currency=USD&region=nac
R31 = ERJ-1GNF3902C: Resistor; Manufacturer_Name: Panasonic; Datasheet Link: https://industrial.panasonic.com/cdbs/www-data/pdf/RDA0000/AOA0000C301.pdf; Height: 0.26mm; Manufacturer_Part_Number: ERJ-1GNF3902C; Mouser Part Number: 667-ERJ-1GNF3902C; Mouser Price/Stock: https://www.mouser.co.uk/ProductDetail/Panasonic/ERJ-1GNF3902C?qs=nuXzIS8loXHDGgRLL9kxuw%3D%3D; Arrow Part Number: ERJ-1GNF3902C; Arrow Price/Stock: https://www.arrow.com/en/products/erj-1gnf3902c/panasonic
R32 = CMP-2004-03399-1: Part Number: ERJ-1GNF6492C; Manufacturer: Panasonic
R33 = CMP-2004-03561-1: Part Number: ERJ1GNF9102C; Manufacturer: Panasonic
R34 = ERJ-1GNF1692C: Resistor; Manufacturer_Name: Panasonic; Datasheet Link: https://industrial.panasonic.com/cdbs/www-data/pdf/RDA0000/AOA0000C301.pdf; Height: 0.26mm; Manufacturer_Part_Number: ERJ-1GNF1692C; Mouser Part Number: 667-ERJ-1GNF1692C; Mouser Price/Stock: https://www.mouser.co.uk/ProductDetail/Panasonic/ERJ-1GNF1692C?qs=nuXzIS8loXF5YjzhgcakNQ%3D%3D
R35 = ERJ-1GNF4122C: Resistor; Manufacturer_Name: Panasonic; Datasheet Link: https://industrial.panasonic.com/cdbs/www-data/pdf/RDA0000/AOA0000C301.pdf; Height: 0.26mm; Manufacturer_Part_Number: ERJ-1GNF4122C
R36 = CMP-2004-03066-1: Manufacturer: Panasonic; Part Number: ERJ-1GEF6982C
R37 = CMP-1010-00639-1: 93K1 0.05W 1% 0201 (0603 Metric)  SMD; Case-Metric: 0603; Value: 93100.00 Ohm; Case-EIA: 0201; Tolerance: 1 %; Power: 0.05 W; Technology: SMT
R38 = ERJ-1GNF1912C: Resistor; Manufacturer_Name: Panasonic; Datasheet Link: https://industrial.panasonic.com/cdbs/www-data/pdf/RDA0000/AOA0000C301.pdf; Height: 0.26mm; Manufacturer_Part_Number: ERJ-1GNF1912C; Mouser Part Number: 667-ERJ-1GNF1912C; Mouser Price/Stock: https://www.mouser.com/Search/Refine.aspx?Keyword=667-ERJ-1GNF1912C
R39 = CMP-2004-03546-1: Manufacturer: Panasonic; Part Number: ERJ1GNF4302C
R40 = CMP-1010-00626-2: Manufacturer: Panasonic; Part Number: ERJ-1GNF7152C
R41 = CMP-2004-03438-1: Manufacturer: Panasonic; Part Number: ERJ-1GNF9532C
R42 = ERJ-1GNF2102C: Resistor; Manufacturer_Name: Panasonic; Datasheet Link: https://industrial.panasonic.com/cdbs/www-data/pdf/RDA0000/AOA0000C301.pdf; Height: 0.26mm; Manufacturer_Part_Number: ERJ-1GNF2102C; Mouser Part Number: 667-ERJ-1GNF2102C; Mouser Price/Stock: https://www.mouser.co.uk/ProductDetail/Panasonic/ERJ-1GNF2102C?qs=nuXzIS8loXF4rN4MRKzadQ%3D%3D
R43 = CMP-1010-00603-1: 45K3 0.05W 1% 0201 (0603 Metric)  SMD; Value: 45300.00 Ohm; Case-EIA: 0201; Case-Metric: 0603; Tolerance: 1 %; Technology: SMT; Power: 0.05 W
R44 = CMP-2004-03413-1: Manufacturer: Panasonic; Part Number: ERJ-1GNF7322C
R45 = CMP-1010-00641-2: Manufacturer: Panasonic; Part Number: ERJ-1GNF9762C
R46 = ERJ-1GNF2322C: Resistor; Manufacturer_Name: Panasonic; Datasheet Link: https://industrial.panasonic.com/cdbs/www-data/pdf/RDA0000/AOA0000C301.pdf; Height: 0.26mm; Manufacturer_Part_Number: ERJ-1GNF2322C
R47 = CMP-2004-02976-1: Manufacturer: Panasonic; Part Number: ERJ-1GEF4872C
R48 = CMP-1010-00628-2: Manufacturer: Panasonic; Part Number: ERJ1GNF7502C
R49 = CMP-2004-03446-2: RES SMD 100K OHM 1% 1/20W 0201; Temperature Coefficient: 200ppm/°C; Voltage Rating: 25V; Max Power Dissipation: 50mW; Resistance: 100kR; Packaging: Tape and Reel; Tolerance: 1%; Mount: Surface Mount; Case Code (Metric): 0603; Number of Terminations: 2; Contact Plating: Tin; Case Code (Imperial): 0201; Width: 0.012inch; Lead Free: Lead Free; Radiation Hardening: No; Termination: SMD/SMT; Weight: 6E-06oz; Height: 0.01inch; Max Operating Temperature: 125°C; Number of Pins: 2; REACH SVHC: No SVHC; Power Rating: 50mW; Voltage Rating (DC): 25V; Package Quantity: 15000; Case/Package: 0201; Min Operating Temperature: -55°C; Length: 0.024inch; Composition: Thick Film
R51 R52 = CMP-2002-00433-1: Part Number: ERJ-2GEJ103X; Manufacturer: Panasonic
SW1 SW2 = CMP-10040-000001-2: SWITCH TACTILE SPST-NO 0.05A 16V; Throw Configuration: SPST; Operating Force: 160gf; Actuator Type: Standard; Switch Travel: 0.15mm; Switch Function: Off-Mom; Max Current Rating: 50mA; Mechanical Life: 150000Cycles; Illumination Type: Non-Illuminated; Package Quantity: 2900; Depth: 4.6mm; Mount: Surface Mount; Packaging: Tape and Reel; Length: 3.2mm; RoHS Compliant: Yes; Case/Package: SMD/SMT; Voltage Rating (DC): 16V; Min Operating Temperature: -40°C; Termination: J-Bend; Lead Free: Lead Free; Contact Plating: Silver; Orientation: Straight; Max Operating Temperature: 85°C; Current Rating: 50mA; Color: Black
U1 = CMP-0236-00227-2: ARM Cortex-M3 32-bit MCU, 128 KB Flash, 32 KB Internal RAM, 83 I/Os, 100-Pin LQFP, -40 to 85 degC, Tape and Reel; Manufacturer: STMicroelectronics; Operating Frequency(F) (Processor speed) (MHz): 32; D/A Converter: 2; FLASH Size (Prog) (kB): 128; Supply Voltage(Vcc) min (V): 1.8; I/Os (High Current): 82; Data E2PROM nom (B): 4096; ComponentLink2URL: http://www.st.com/st-web-ui/static/active/en/resource/technical/document/datasheet/DM00078689.pdf; DatasheetVersion: Rev. 4; ComponentLink1URL: http://www.st.com/; ComponentLink2Description: Datasheet; Package Description: 100-Pin Low Profile Quad Flat Package, Body 14 x 14 mm, Pitch 0.5 mm; Package Reference: LQFP100; Mounting Technology: Surface Mount; ComponentLink1Description: Manufacturer URL; Internal RAM Size (kB): 32; Packing: Tape and Reel; Core: ARM Cortex-M3; PartNumber: STM32L152VBT6ATR

## Sheet CellSelectModule.SchDoc
size A4; SheetNumber: 2; SheetTotal: 2
Used 48 times, as channels CellSelectModule, CellSelectModule, CellSelectModule, CellSelectModule, CellSelectModule, CellSelectModule, CellSelectModule, CellSelectModule, CellSelectModule, CellSelectModule, CellSelectModule, CellSelectModule, CellSelectModule, CellSelectModule, CellSelectModule, CellSelectModule, CellSelectModule, CellSelectModule, CellSelectModule, CellSelectModule, CellSelectModule, CellSelectModule, CellSelectModule, CellSelectModule, CellSelectModule, CellSelectModule, CellSelectModule, CellSelectModule, CellSelectModule, CellSelectModule, CellSelectModule, CellSelectModule, CellSelectModule, CellSelectModule, CellSelectModule, CellSelectModule, CellSelectModule, CellSelectModule, CellSelectModule, CellSelectModule, CellSelectModule, CellSelectModule, CellSelectModule, CellSelectModule, CellSelectModule, CellSelectModule, CellSelectModule, CellSelectModule. Parts and nets are listed once, with the designators drawn on the sheet.
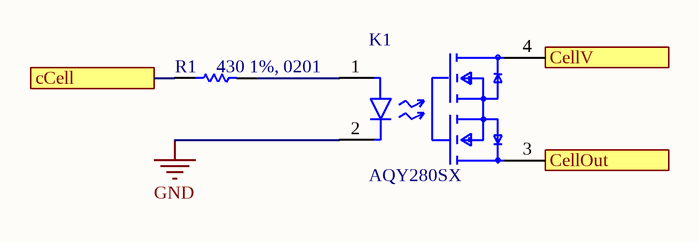
[diagram p1: CellSelectModule.SchDoc]

### Parts
K1  AQY280SX  [FP-AQY280SX-MFG]
R1  430 1%, 0201  [RESC0603X26X15NL03T05]

### Ports
cCell (see CellVoltageControl[2C]), CellOut (see CellVoltageControl[2C]), CellV (see CellVoltageControl[2C])

### Nets
GND: K1.2(C)
cCell: R1.1 ; port cCell
CellOut: K1.3(1_DRAIN) ; port CellOut
CellV: K1.4(2_DRAIN) ; port CellV
NetK1_1: K1.1(A) R1.2

### Channels
CellSelectModule: designators end in _CellSelectModule#1; ports cCell=cCell-1 CellOut=V+ CellV=NetK1_CellSelectModule#1_4
CellSelectModule: designators end in _CellSelectModule#2; ports cCell=cCell-38 CellOut=V+ CellV=NetK1_CellSelectModule#2_4
CellSelectModule: designators end in _CellSelectModule#3; ports cCell=cCell-39 CellOut=V+ CellV=NetK1_CellSelectModule#3_4
CellSelectModule: designators end in _CellSelectModule#4; ports cCell=cCell-40 CellOut=V+ CellV=NetK1_CellSelectModule#4_4
CellSelectModule: designators end in _CellSelectModule#5; ports cCell=cCell-41 CellOut=V+ CellV=NetK1_CellSelectModule#5_4
CellSelectModule: designators end in _CellSelectModule#6; ports cCell=cCell-42 CellOut=V+ CellV=NetK1_CellSelectModule#6_4
CellSelectModule: designators end in _CellSelectModule#7; ports cCell=cCell-43 CellOut=V+ CellV=NetK1_CellSelectModule#7_4
CellSelectModule: designators end in _CellSelectModule#8; ports cCell=cCell-44 CellOut=V+ CellV=NetK1_CellSelectModule#8_4
CellSelectModule: designators end in _CellSelectModule#9; ports cCell=cCell-45 CellOut=V+ CellV=NetK1_CellSelectModule#9_4
CellSelectModule: designators end in _CellSelectModule#10; ports cCell=cCell-46 CellOut=V+ CellV=NetK1_CellSelectModule#10_4
CellSelectModule: designators end in _CellSelectModule#11; ports cCell=cCell-47 CellOut=V+ CellV=NetK1_CellSelectModule#11_4
CellSelectModule: designators end in _CellSelectModule#12; ports cCell=cCell-48 CellOut=V+ CellV=NetK1_CellSelectModule#12_4
CellSelectModule: designators end in _CellSelectModule#13; ports cCell=cCell-26 CellOut=V+ CellV=NetK1_CellSelectModule#13_4
CellSelectModule: designators end in _CellSelectModule#14; ports cCell=cCell-27 CellOut=V+ CellV=NetK1_CellSelectModule#14_4
CellSelectModule: designators end in _CellSelectModule#15; ports cCell=cCell-28 CellOut=V+ CellV=NetK1_CellSelectModule#15_4
CellSelectModule: designators end in _CellSelectModule#16; ports cCell=cCell-29 CellOut=V+ CellV=NetK1_CellSelectModule#16_4
CellSelectModule: designators end in _CellSelectModule#17; ports cCell=cCell-30 CellOut=V+ CellV=NetK1_CellSelectModule#17_4
CellSelectModule: designators end in _CellSelectModule#18; ports cCell=cCell-31 CellOut=V+ CellV=NetK1_CellSelectModule#18_4
CellSelectModule: designators end in _CellSelectModule#19; ports cCell=cCell-32 CellOut=V+ CellV=NetK1_CellSelectModule#19_4
CellSelectModule: designators end in _CellSelectModule#20; ports cCell=cCell-33 CellOut=V+ CellV=NetK1_CellSelectModule#20_4
CellSelectModule: designators end in _CellSelectModule#21; ports cCell=cCell-34 CellOut=V+ CellV=NetK1_CellSelectModule#21_4
CellSelectModule: designators end in _CellSelectModule#22; ports cCell=cCell-35 CellOut=V+ CellV=NetK1_CellSelectModule#22_4
CellSelectModule: designators end in _CellSelectModule#23; ports cCell=cCell-36 CellOut=V+ CellV=NetK1_CellSelectModule#23_4
CellSelectModule: designators end in _CellSelectModule#24; ports cCell=cCell-37 CellOut=V+ CellV=NetK1_CellSelectModule#24_4
CellSelectModule: designators end in _CellSelectModule#25; ports cCell=cCell-14 CellOut=V+ CellV=NetK1_CellSelectModule#25_4
CellSelectModule: designators end in _CellSelectModule#26; ports cCell=cCell-15 CellOut=V+ CellV=NetK1_CellSelectModule#26_4
CellSelectModule: designators end in _CellSelectModule#27; ports cCell=cCell-16 CellOut=V+ CellV=NetK1_CellSelectModule#27_4
CellSelectModule: designators end in _CellSelectModule#28; ports cCell=cCell-17 CellOut=V+ CellV=NetK1_CellSelectModule#28_4
CellSelectModule: designators end in _CellSelectModule#29; ports cCell=cCell-18 CellOut=V+ CellV=NetK1_CellSelectModule#29_4
CellSelectModule: designators end in _CellSelectModule#30; ports cCell=cCell-19 CellOut=V+ CellV=NetK1_CellSelectModule#30_4
CellSelectModule: designators end in _CellSelectModule#31; ports cCell=cCell-20 CellOut=V+ CellV=NetK1_CellSelectModule#31_4
CellSelectModule: designators end in _CellSelectModule#32; ports cCell=cCell-21 CellOut=V+ CellV=NetK1_CellSelectModule#32_4
CellSelectModule: designators end in _CellSelectModule#33; ports cCell=cCell-22 CellOut=V+ CellV=NetK1_CellSelectModule#33_4
CellSelectModule: designators end in _CellSelectModule#34; ports cCell=cCell-23 CellOut=V+ CellV=NetK1_CellSelectModule#34_4
CellSelectModule: designators end in _CellSelectModule#35; ports cCell=cCell-24 CellOut=V+ CellV=NetK1_CellSelectModule#35_4
CellSelectModule: designators end in _CellSelectModule#36; ports cCell=cCell-25 CellOut=V+ CellV=NetK1_CellSelectModule#36_4
CellSelectModule: designators end in _CellSelectModule#37; ports cCell=cCell-2 CellOut=V+ CellV=NetK1_CellSelectModule#37_4
CellSelectModule: designators end in _CellSelectModule#38; ports cCell=cCell-3 CellOut=V+ CellV=NetK1_CellSelectModule#38_4
CellSelectModule: designators end in _CellSelectModule#39; ports cCell=cCell-4 CellOut=V+ CellV=NetK1_CellSelectModule#39_4
CellSelectModule: designators end in _CellSelectModule#40; ports cCell=cCell-5 CellOut=V+ CellV=NetK1_CellSelectModule#40_4
CellSelectModule: designators end in _CellSelectModule#41; ports cCell=cCell-6 CellOut=V+ CellV=NetK1_CellSelectModule#41_4
CellSelectModule: designators end in _CellSelectModule#42; ports cCell=cCell-7 CellOut=V+ CellV=NetK1_CellSelectModule#42_4
CellSelectModule: designators end in _CellSelectModule#43; ports cCell=cCell-8 CellOut=V+ CellV=NetK1_CellSelectModule#43_4
CellSelectModule: designators end in _CellSelectModule#44; ports cCell=cCell-9 CellOut=V+ CellV=NetK1_CellSelectModule#44_4
CellSelectModule: designators end in _CellSelectModule#45; ports cCell=cCell-10 CellOut=V+ CellV=NetK1_CellSelectModule#45_4
CellSelectModule: designators end in _CellSelectModule#46; ports cCell=cCell-11 CellOut=V+ CellV=NetK1_CellSelectModule#46_4
CellSelectModule: designators end in _CellSelectModule#47; ports cCell=cCell-12 CellOut=V+ CellV=NetK1_CellSelectModule#47_4
CellSelectModule: designators end in _CellSelectModule#48; ports cCell=cCell-13 CellOut=V+ CellV=NetK1_CellSelectModule#48_4

### Library data of the parts
K1 = CMP-00287-00695349-1: AQY280SX AQY Photomos Series 120 mA 350 V 25 Ohm SMT 1 Channel Solid State Relay -SOP-4; NexarPartId: 695349; Output Current: 120mA; Throw Configuration: DPST, SPST; Resistance: 25Ω; Max Input Current: 50mA; Max Output Voltage: 350V; Isolation Voltage: 1.5kV; Termination: Gull Wing; Number of Pins: 4; Max Output Current: 120mA; RoHS: Compliant; Mount: Surface Mount; Radiation Hardening: No; Max Operating Temperature: 85°C; Height: 2.1mm; Case/Package: SOP; Forward Current: 50mA; Input Current: 50mA; Lead Free: Lead Free; Length: 4.4mm; Width: 4.3mm; Min Operating Temperature: -40°C; Output Voltage: 350V; Relay Type: Relay; Load Current: 120mA
R1 = CMP-2004-03546-1: as R39 on sheet CellVoltageControl

## Sheet LDO_3V3.SchDoc
size A4; SheetNumber: 4; SheetTotal: 6
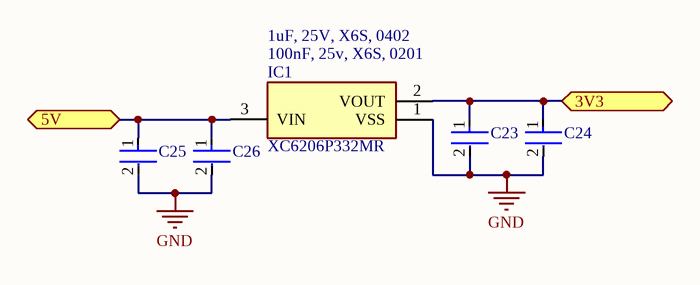
[diagram p2: LDO_3V3.SchDoc]

### Parts
C23  100nF, 25v, X6S, 0201  [FP-GRM033-0_03-IPC_B]  (value not drawn)
C24  1uF, 25V, X6S, 0402  [FP-GRT155-0_1-IPC_A]  (value not drawn)
C25  1uF, 25V, X6S, 0402  [FP-GRT155-0_1-IPC_A]  (value not drawn)
C26  100nF, 25v, X6S, 0201  [FP-GRM033-0_03-IPC_B]  (value not drawn)
IC1  XC6206P332MR  [SOT95P280X130-3N]

### Ports
3V3 (bidir, see CellVoltageControl[1C]), 5V (bidir)

### Nets
3V3: C23.1 C24.1 IC1.2(VOUT) ; port 3V3
5V: C25.1 C26.1 IC1.3(VIN) ; port 5V
GND: C23.2 C24.2 C25.2 C26.2 IC1.1(VSS)

### Notes on the sheet
- (near IC1) 100nF, 25v, X6S, 0201
- (near IC1) 1uF, 25V, X6S, 0402

### Library data of the parts
C23 C26 = CMP-06035-023320-1: Chip Multilayer Ceramic Capacitors for General Purpose, 0201, 0.10uF, X6S, 22%, 10%, 25V; Height: 0.3mm; Width: 0.3mm; Weight: 1.2E-05oz; Min Operating Temperature: -55°C; Dielectric: X6S; Packaging: Tape and Reel; Tolerance: 10%; Mount: Surface Mount; Case Code (Imperial): 0201; Case/Package: 0201; Max Operating Temperature: 105°C; Case Code (Metric): 0603; Voltage Rating: 25V; Capacitance: 100nF; Package Quantity: 15000; Thickness: 0.013inch; Length: 0.024inch; Termination: SMD/SMT; Voltage Rating (DC): 25V
C24 C25 = CMP-06035-047663-1: as C14 on sheet CellVoltageControl
IC1 = XC6206P332MR: Integrated Circuit; Manufacturer_Name: Torex; Datasheet Link: http://www.torexsemi.com/products/voltage_regulators/data/XC6206.pdf; Height: 1.3mm; Manufacturer_Part_Number: XC6206P332MR; Mouser Part Number: N/A; Mouser Price/Stock: https://www.mouser.co.uk/ProductDetail/Torex-Semiconductor/XC6206P332MR?qs=TiOZkKH1s2Qxu69VLzzkSQ%3D%3D

## Sheet ISO_Power.SchDoc
size A4; SheetNumber: 4; SheetTotal: 7
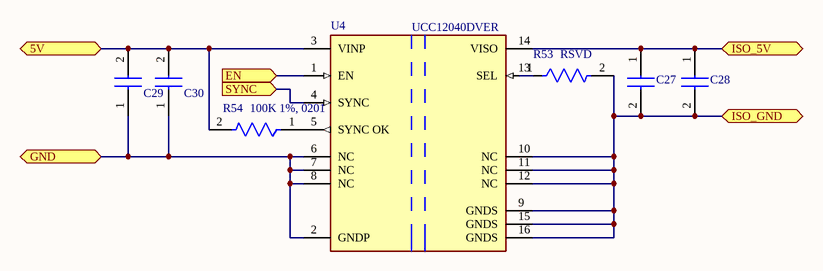
[diagram p3: ISO_Power.SchDoc]

### Parts
C27  100 nF, 25V, X6S, 0201  [CAPC0603X33N]  (value not drawn)
C28  10 uF, 25V, X6S, 0402  [CAPC1005X70N]  (value not drawn)
C29  10 uF, 25V, X6S, 0402  [CAPC1005X70N]  (value not drawn)
C30  100 nF, 25V, X6S, 0201  [CAPC0603X33N]  (value not drawn)
R53  RSVD  [FP-ERJ1GN-IPC_A]  (no BOM)
R54  100K 1%, 0201  [FP-ERJ1GN-IPC_A]
U4  UCC12040DVER  [FP-DVE0016A-MFG]

### Ports
5V (bidir, see CellVoltageControl[2C]), EN (in, see CellVoltageControl[2C]), GND (bidir, see CellVoltageControl[2C]), ISO_5V (bidir, see CellVoltageControl[3C]), ISO_GND (bidir, see CellVoltageControl[3C]), SYNC (in, see CellVoltageControl[2C])

### Nets
5V: C29.2 C30.2 R54.2 U4.3(VINP) ; port 5V
GND: C29.1 C30.1 U4.2(GNDP) U4.6(NC) U4.7(NC) U4.8(NC) ; port GND
ISO_5V: C27.1 C28.1 U4.14(VISO) ; port ISO_5V
ISO_GND: C27.2 C28.2 R53.2 U4.9(GNDS) U4.10(NC) U4.11(NC) U4.12(NC) U4.15(GNDS) U4.16(GNDS) ; port ISO_GND
NetR53_1: R53.1 U4.13(SEL)
NetR54_1: R54.1 U4.5(SYNC_OK)
NetU4_1: U4.1(EN) ; port EN
NetU4_4: U4.4(SYNC) ; port SYNC

### Library data of the parts
C27 C30 = GRM033C81E104KE14D: as C1 on sheet CellVoltageControl; Datasheet Link: https://search.murata.co.jp/Ceramy/image/img/A01X/G101/ENG/GRM033C81E104KE14-01A.pdf; Height: 0.33mm; Manufacturer_Part_Number: GRM033C81E104KE14D; Mouser Part Number: 81-GRM33C81E104KE14D; Mouser Price/Stock: https://www.mouser.co.uk/ProductDetail/Murata-Electronics/GRM033C81E104KE14D?qs=P%2FC4Eoq9CDwxe7d5nXqGrA%3D%3D; Arrow Part Number: GRM033C81E104KE14D; Arrow Price/Stock: https://www.arrow.com/en/products/grm033c81e104ke14d/murata-manufacturing
C28 C29 = GRM155F51E104ZA01E: Capacitor; Manufacturer_Name: Murata Electronics; Datasheet Link: http://www.murata.com/~/media/webrenewal/support/library/catalog/products/capacitor/mlcc/c02e.pdf; Height: 0.7mm; Manufacturer_Part_Number: GRM155F51E104ZA01E; Mouser Part Number: 81-GRM15F51E104ZA01E; Mouser Price/Stock: https://www.mouser.com/Search/Refine.aspx?Keyword=81-GRM15F51E104ZA01E
R53 R54 = CMP-2004-03446-2: as R49 on sheet CellVoltageControl; Packaging: Tape and Reel; Tolerance: 1%; Mount: Surface Mount; Case Code (Metric): 0603; Number of Terminations: 2; Contact Plating: Tin; Case Code (Imperial): 0201; Width: 0.012inch; Lead Free: Lead Free; Radiation Hardening: No; Termination: SMD/SMT; Weight: 6E-06oz; Height: 0.01inch; Max Operating Temperature: 125°C; Number of Pins: 2; REACH SVHC: No SVHC; Power Rating: 50mW; Voltage Rating (DC): 25V; Package Quantity: 15000; Case/Package: 0201; Min Operating Temperature: -55°C; Length: 0.024inch; Composition: Thick Film
U4 = CMP-04910-000064-1: DC DC CONVERTER 3.3V 5V 500MW